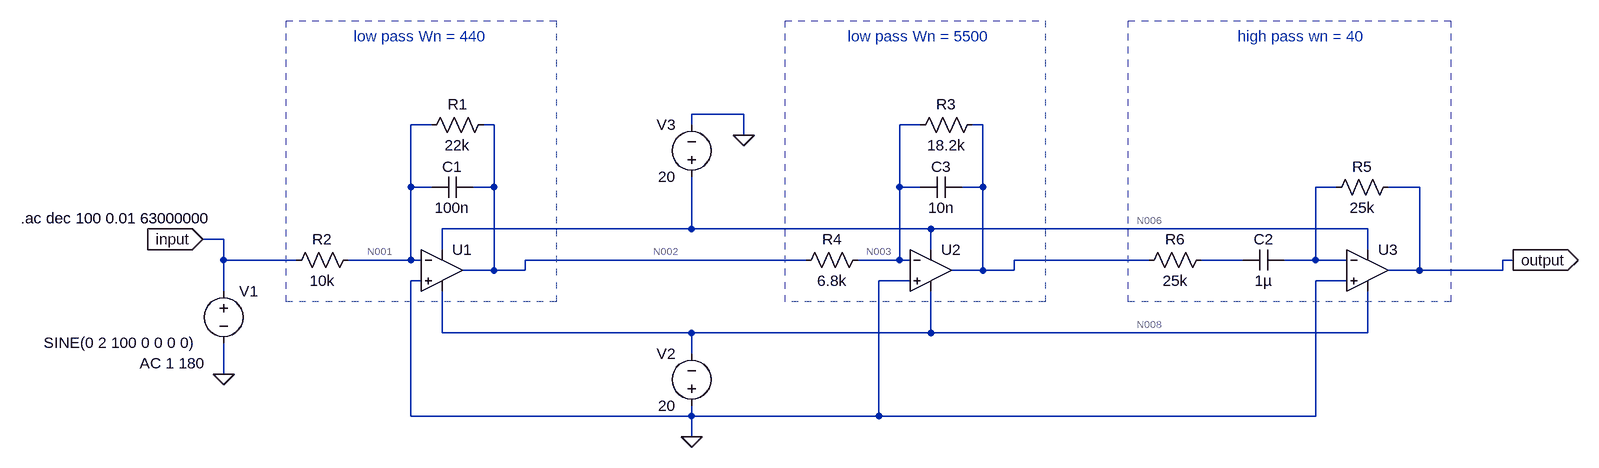
[diagram p0: schematic spice.asc]
spice.asc, the LTspice schematic file:
Version 4
SHEET 1 1432 680
WIRE 112 -320 32 -320
WIRE -368 -304 -400 -304
WIRE -272 -304 -288 -304
WIRE 32 -304 32 -320
WIRE 384 -304 352 -304
WIRE 480 -304 464 -304
WIRE 112 -288 112 -320
WIRE -400 -208 -400 -304
WIRE -368 -208 -400 -208
WIRE -272 -208 -272 -304
WIRE -272 -208 -304 -208
WIRE 352 -208 352 -304
WIRE 384 -208 352 -208
WIRE 480 -208 480 -304
WIRE 480 -208 448 -208
WIRE 1024 -208 992 -208
WIRE 1152 -208 1104 -208
WIRE 32 -144 32 -224
WIRE 32 -144 -352 -144
WIRE 400 -144 32 -144
WIRE 1072 -144 400 -144
WIRE -688 -128 -720 -128
WIRE -352 -112 -352 -144
WIRE 400 -112 400 -144
WIRE 1072 -112 1072 -144
WIRE -688 -96 -688 -128
WIRE -576 -96 -688 -96
WIRE -400 -96 -400 -208
WIRE -400 -96 -496 -96
WIRE -384 -96 -400 -96
WIRE 208 -96 -224 -96
WIRE 352 -96 352 -208
WIRE 352 -96 288 -96
WIRE 368 -96 352 -96
WIRE 736 -96 528 -96
WIRE 880 -96 816 -96
WIRE 992 -96 992 -208
WIRE 992 -96 944 -96
WIRE 1040 -96 992 -96
WIRE 1296 -96 1280 -96
WIRE -272 -80 -272 -208
WIRE -272 -80 -320 -80
WIRE -224 -80 -224 -96
WIRE -224 -80 -272 -80
WIRE 480 -80 480 -208
WIRE 480 -80 432 -80
WIRE 528 -80 528 -96
WIRE 528 -80 480 -80
WIRE 1152 -80 1152 -208
WIRE 1152 -80 1104 -80
WIRE 1280 -80 1280 -96
WIRE 1280 -80 1152 -80
WIRE -384 -64 -400 -64
WIRE 368 -64 320 -64
WIRE 1040 -64 992 -64
WIRE -688 -48 -688 -96
WIRE -352 16 -352 -48
WIRE 32 16 -352 16
WIRE 400 16 400 -48
WIRE 400 16 32 16
WIRE 1072 16 1072 -48
WIRE 1072 16 400 16
WIRE 32 48 32 16
WIRE -688 80 -688 32
WIRE -400 144 -400 -64
WIRE 32 144 32 128
WIRE 32 144 -400 144
WIRE 320 144 320 -64
WIRE 320 144 32 144
WIRE 992 144 992 -64
WIRE 992 144 320 144
WIRE 32 176 32 144
FLAG -688 80 0
FLAG 112 -288 0
FLAG -720 -128 input
IOPIN -720 -128 In
FLAG 1296 -96 output
IOPIN 1296 -96 Out
FLAG 32 176 0
SYMBOL OpAmps\\UniversalOpAmp -352 -80 R0
SYMATTR InstName U1
SYMBOL OpAmps\\UniversalOpAmp 400 -80 R0
SYMATTR InstName U2
SYMBOL OpAmps\\UniversalOpAmp 1072 -80 R0
SYMATTR InstName U3
SYMBOL res -272 -320 R90
WINDOW 0 0 56 VBottom 2
WINDOW 3 32 56 VTop 2
SYMATTR InstName R1
SYMATTR Value 22k
SYMBOL cap -304 -224 R90
WINDOW 0 0 32 VBottom 2
WINDOW 3 32 32 VTop 2
SYMATTR InstName C1
SYMATTR Value 100n
SYMBOL res -480 -112 R90
WINDOW 0 0 56 VBottom 2
WINDOW 3 32 56 VTop 2
SYMATTR InstName R2
SYMATTR Value 10k
SYMBOL voltage -688 -64 R0
WINDOW 123 -129 127 Left 2
WINDOW 39 0 0 Left 0
WINDOW 3 -277 95 Left 2
SYMATTR Value2 AC 1 180
SYMATTR InstName V1
SYMATTR Value SINE(0 2 100 0 0 0 0)
SYMBOL res 304 -112 R90
WINDOW 0 0 56 VBottom 2
WINDOW 3 32 56 VTop 2
SYMATTR InstName R4
SYMATTR Value 6.8k
SYMBOL cap 448 -224 R90
WINDOW 0 0 32 VBottom 2
WINDOW 3 32 32 VTop 2
SYMATTR InstName C3
SYMATTR Value 10n
SYMBOL res 480 -320 R90
WINDOW 0 0 56 VBottom 2
WINDOW 3 32 56 VTop 2
SYMATTR InstName R3
SYMATTR Value 18.2k
SYMBOL res 1120 -224 R90
WINDOW 0 0 56 VBottom 2
WINDOW 3 32 56 VTop 2
SYMATTR InstName R5
SYMATTR Value 25k
SYMBOL cap 944 -112 R90
WINDOW 0 0 32 VBottom 2
WINDOW 3 32 32 VTop 2
SYMATTR InstName C2
SYMATTR Value 1µ
SYMBOL res 832 -112 R90
WINDOW 0 0 56 VBottom 2
WINDOW 3 32 56 VTop 2
SYMATTR InstName R6
SYMATTR Value 25k
SYMBOL voltage 32 -208 R180
WINDOW 0 24 96 Left 2
WINDOW 3 24 16 Left 2
WINDOW 123 0 0 Left 0
WINDOW 39 0 0 Left 0
SYMATTR InstName V3
SYMATTR Value 20
SYMBOL voltage 32 144 R180
WINDOW 0 24 96 Left 2
WINDOW 3 24 16 Left 2
WINDOW 123 0 0 Left 0
WINDOW 39 0 0 Left 0
SYMATTR InstName V2
SYMATTR Value 20
TEXT -488 -440 Left 2 ;low pass Wn = 440
TEXT 272 -440 Left 2 ;low pass Wn = 5500
TEXT 872 -440 Left 2 ;high pass wn = 40
TEXT -1000 -160 Left 2 !.ac dec 100 0.01 63000000
RECTANGLE Normal -176 -32 -592 -464 1
RECTANGLE Normal 576 -32 176 -464 1
RECTANGLE Normal 1200 -32 704 -464 1

The netlist it stands for:
* spice.asc
XU1 0 N001 N006 N008 N002 level1 Avol=1Meg GBW=10Meg Vos=0 En=0 Enk=0 In=0 Ink=0 Rin=500Meg  ; pins In+ In- V+ V- OUT
XU2 0 N003 N006 N008 N004 level1 Avol=1Meg GBW=10Meg Vos=0 En=0 Enk=0 In=0 Ink=0 Rin=500Meg  ; pins In+ In- V+ V- OUT
XU3 0 N005 N006 N008 output level1 Avol=1Meg GBW=10Meg Vos=0 En=0 Enk=0 In=0 Ink=0 Rin=500Meg  ; pins In+ In- V+ V- OUT
R1 N002 N001 22k
C1 N002 N001 100n
R2 N001 input 10k
V1 input 0 SINE(0 2 100 0 0 0 0) AC 1 180
R4 N003 N002 6.8k
C3 N004 N003 10n
R3 N004 N003 18.2k
R5 output N005 25k
C2 N005 N007 1µ
R6 N007 N004 25k
V3 N006 0 20
V2 0 N008 20
* low pass Wn = 440
* low pass Wn = 5500
* high pass wn = 40
.ac dec 100 0.01 63000000
.lib UniversalOpAmp1.lib
.backanno
.end

* Results of the author's LTspice run, read from the files saved beside the schematic
* Operating Point, zero values left out:
*   V(n006) = 20 V
*   V(n008) = -20 V
*   I(V2) = -120 nA
*   I(V3) = -120 nA
*   Ix(u1:3) = 40 nA
*   Ix(u1:4) = -40 nA
*   Ix(u2:3) = 40 nA
*   Ix(u2:4) = -40 nA
*   Ix(u3:3) = 40 nA
*   Ix(u3:4) = -40 nA
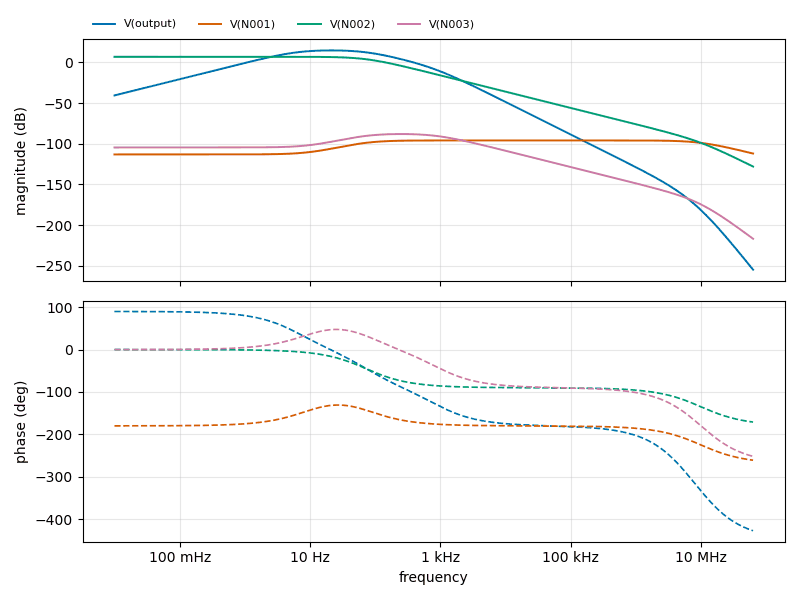
[diagram p1: AC Analysis of spice.asc, plotted from the saved traces]
* AC Analysis, 1 run:
*   V(output): -40.68 dB at 10 mHz, -254.78 dB at 63 MHz, peak 14.66 dB at 21.38 Hz, 3 dB below the peak at 5.469 Hz and 83.55 Hz
*   V(N001): -113.15 dB at 10 mHz, -112.06 dB at 63 MHz, peak -95.96 dB at 26.92 kHz, 3 dB below the peak at 70.95 Hz and 10 MHz
*   V(N002): 6.85 dB at 10 mHz, -128.05 dB at 63 MHz, peak 6.85 dB at 10 mHz, 3 dB below the peak at 72.34 Hz
*   V(N003): -104.60 dB at 10 mHz, -216.75 dB at 63 MHz, peak -88.10 dB at 251.2 Hz, 3 dB below the peak at 61.33 Hz and 1.008 kHz